# Altium schematic sheet V1.0.SchDoc
size 127 x 101 mm
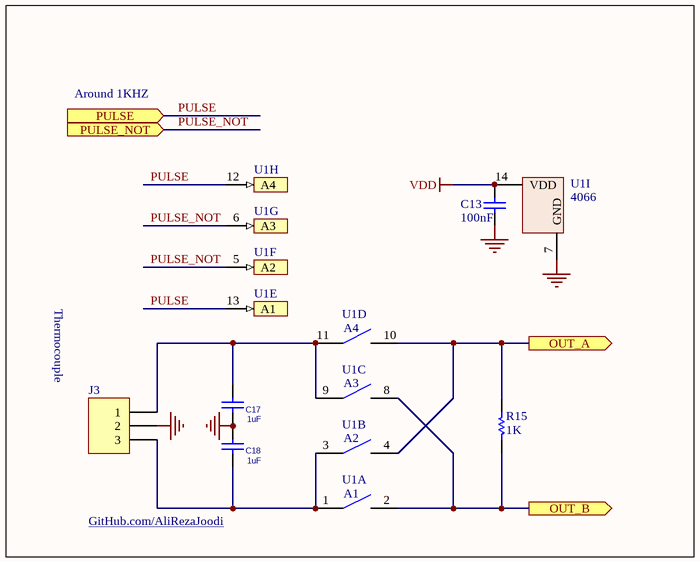
[diagram p0: V1.0.SchDoc]

## Parts
C13  100nF  [CAPNTO2.54-3.05x1.78A]
C17  1uF  [C_SMD_CER_0805]
C18  1uF  [C_SMD_CER_0805]
J3  3PIN  [Fonics_3PIN_1]  (value not drawn)
R15  1K  [AXIAL-0.4]
U1  4066  [DIP14]  (value not drawn)  (parts A,B,C,D,E,F,G,H,I of 9)

## Ports
OUT_A (out), OUT_B (out), PULSE (in), PULSE_NOT (in)

## Nets
GND: C13.1 C17.2 C18.1 J3.2 U1.7(GND)
VDD: C13.2 U1.14(VDD)
OUT_A: R15.2 U1.4(Y2) U1.10(Y4) ; port OUT_A
OUT_B: R15.1 U1.2(Y1) U1.8(Y3) ; port OUT_B
PULSE: U1.12(A4) U1.13(A1) ; port PULSE
PULSE_NOT: U1.5(A2) U1.6(A3) ; port PULSE_NOT
NetC17_1: C17.1 J3.1 U1.9(X3) U1.11(X4)
NetC18_2: C18.2 J3.3 U1.1(X1) U1.3(X2)

## Notes on the sheet
- Around 1KHZ
- Thermocouple
- GitHub.com/AliRezaJoodi

## Library data of the parts
C13 = Cap: Capacitor; Manufacturer: Generic Components; Class I: Passive; Published: 8-Jun-2000; Revision: July-2002: Re-released for DXP Platform.; Publisher: Altium Limited; Class II: Capacitor
C17 C18 = Capacitor_Ceramic: Capacitor, Ceramic Multilayer
J3 = Header 3: Header, 3-Pin; Manufacturer: Generic Components; Class I: Connector; Revision: July-2002: Re-released for DXP Platform.; Publisher: Altium Limited
R15 = Res1: Resistor; Published: 8-Jun-2000; LatestRevisionDate: 17-Jul-2002; LatestRevisionNote: Re-released for DXP Platform.; PackageReference: AXIAL-0.3; Publisher: Altium Limited
U1 = CD4066: Switch